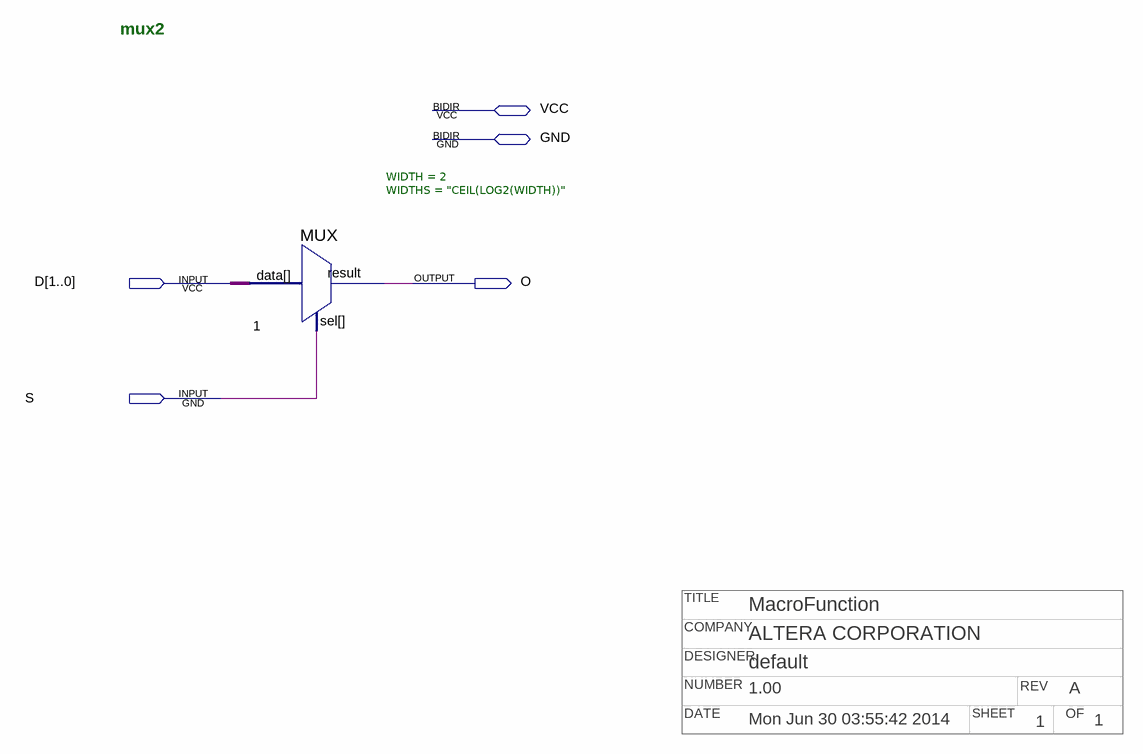
[diagram p0: schematic sheet]
// Quartus schematic npmux2.bdf as structural Verilog: 1 symbols, 5 pins
// Title block: TITLE: MacroFunction; COMPANY: ALTERA CORPORATION; DESIGNER: default; NUMBER: 1.00; REV: A; DATE: Mon Jun 30 03:55:42 2014; SHEET: 1; OF: 1
module npmux2 (
  input  [1:0] D,
  input  S,
  inout  VCC,
  inout  GND,
  output O
);

  MUX #(.WIDTH(2), .WIDTHS("CEIL(LOG2(WIDTH))")) u_1 (.data(D), .sel(S), .result(O));

  // Notes on the sheet:
  //   mux2
endmodule
